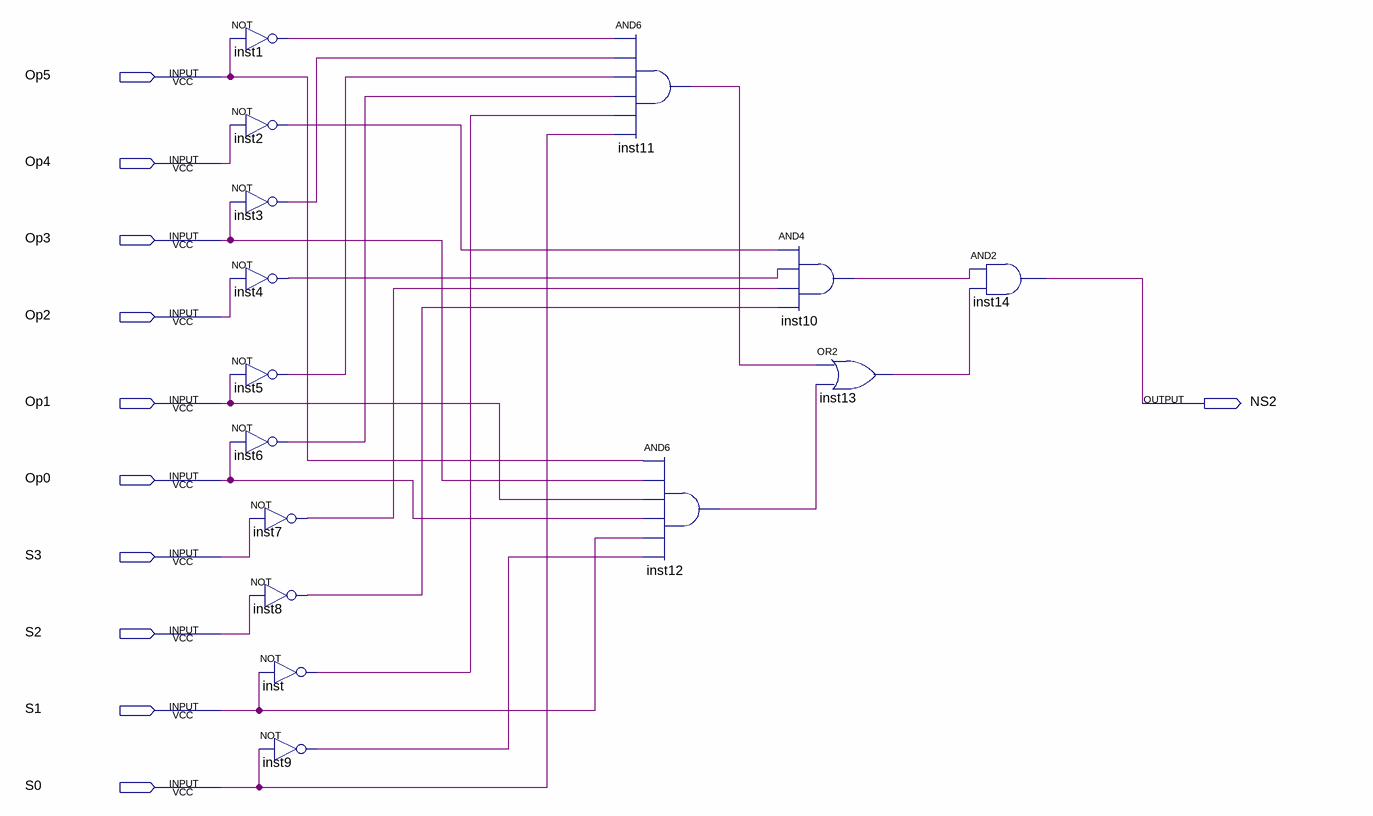
[diagram p0: schematic sheet]
// Quartus schematic NS2.bdf as structural Verilog: 15 symbols, 11 pins
module NS2 (
  input  Op5,
  input  Op4,
  input  Op3,
  input  Op2,
  input  Op1,
  input  Op0,
  input  S3,
  input  S2,
  input  S1,
  input  S0,
  output NS2
);

  wire inst1_out, inst2_out, inst3_out, inst4_out, inst5_out, inst6_out, inst7_out, inst8_out, inst9_out,
       inst10_out, inst11_out, inst12_out, inst13_out, inst_out;

  not inst1 (inst1_out, Op5);
  not inst2 (inst2_out, Op4);
  not inst3 (inst3_out, Op3);
  not inst4 (inst4_out, Op2);
  not inst5 (inst5_out, Op1);
  not inst6 (inst6_out, Op0);
  not inst7 (inst7_out, S3);
  not inst8 (inst8_out, S2);
  not inst (inst_out, S1);
  not inst9 (inst9_out, S0);
  and inst11 (inst11_out, inst1_out, inst3_out, inst5_out, inst6_out, inst_out, S0);
  and inst12 (inst12_out, Op5, Op3, Op1, Op0, S1, inst9_out);
  and inst10 (inst10_out, inst2_out, inst4_out, inst7_out, inst8_out);
  or inst13 (inst13_out, inst11_out, inst12_out);
  and inst14 (NS2, inst10_out, inst13_out);
endmodule
